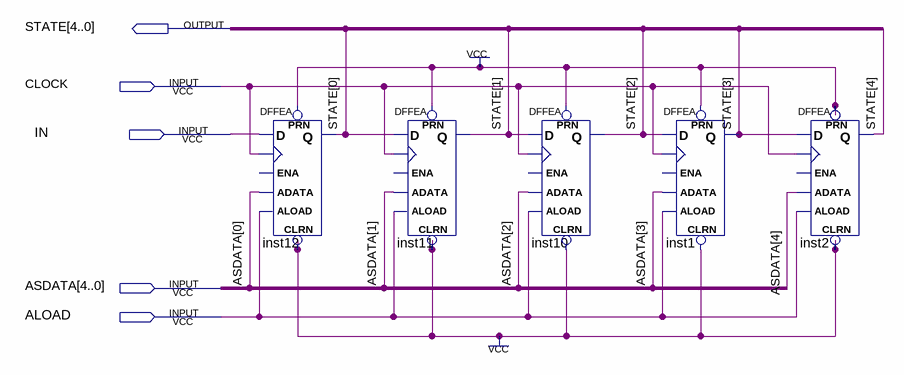
[diagram p0: schematic sheet]
// Quartus schematic Shift_Reg.bdf as structural Verilog: 5 symbols, 5 pins
module Shift_Reg (
  input  CLOCK,
  input  IN,
  input  [4:0] ASDATA,
  input  ALOAD,
  output [4:0] STATE
);

  DFFEA inst12 (
    .PRN(1'b1), .ALOAD(ALOAD), .ADATA(ASDATA[0]), .CLK(CLOCK), .D(IN), .CLRN(1'b1), .Q(STATE[0]));  // open: ENA
  DFFEA inst11 (
    .PRN(1'b1), .ALOAD(ALOAD), .ADATA(ASDATA[1]), .CLK(CLOCK), .D(STATE[0]), .CLRN(1'b1), .Q(STATE[1]));  // open: ENA
  DFFEA inst10 (
    .PRN(1'b1), .ALOAD(ALOAD), .ADATA(ASDATA[2]), .CLK(CLOCK), .D(STATE[1]), .CLRN(1'b1), .Q(STATE[2]));  // open: ENA
  DFFEA inst1 (
    .PRN(1'b1), .ALOAD(ALOAD), .ADATA(ASDATA[3]), .CLK(CLOCK), .D(STATE[2]), .CLRN(1'b1), .Q(STATE[3]));  // open: ENA
  DFFEA inst2 (
    .PRN(1'b1), .ALOAD(ALOAD), .ADATA(ASDATA[4]), .CLK(CLOCK), .D(STATE[3]), .CLRN(1'b1), .Q(STATE[4]));  // open: ENA
endmodule
